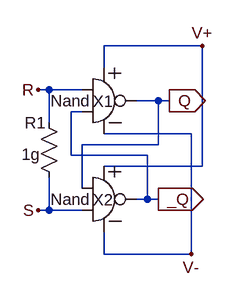
[diagram p0: schematic SrFfNand.asc]
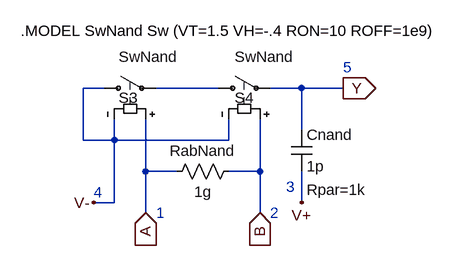
[diagram p1: sub-circuit nand.asc]
SrFfNand.asc, the LTspice schematic file:
Version 4
SHEET 1 880 680
WIRE -16 240 -32 240
WIRE -16 288 -16 240
WIRE -16 416 -32 416
WIRE -16 416 -16 368
WIRE 16 336 16 272
WIRE 32 240 -16 240
WIRE 32 272 16 272
WIRE 32 384 32 320
WIRE 32 416 -16 416
WIRE 64 208 64 176
WIRE 64 480 64 448
WIRE 128 336 16 336
WIRE 128 400 112 400
WIRE 128 400 128 336
WIRE 144 256 112 256
WIRE 144 320 32 320
WIRE 144 320 144 256
WIRE 144 400 128 400
WIRE 160 256 144 256
WIRE 192 304 64 304
WIRE 192 480 64 480
WIRE 192 480 192 304
WIRE 208 176 64 176
WIRE 208 352 64 352
WIRE 208 352 208 176
FLAG 144 400 _Q
IOPIN 144 400 Out
FLAG 160 256 Q
IOPIN 160 256 Out
FLAG -32 416 S
FLAG -32 240 R
FLAG 208 176 V+
FLAG 192 480 V-
SYMBOL res -32 272 R0
WINDOW 0 -20 16 Left 0
WINDOW 3 -24 62 Left 0
SYMATTR InstName R1
SYMATTR Value 1g
SYMBOL Nand 64 192 R0
WINDOW 0 -16 65 Left 0
WINDOW 3 -78 64 Left 0
SYMATTR InstName X1
SYMBOL Nand 64 336 R0
WINDOW 0 -16 65 Left 0
WINDOW 3 -78 64 Left 0
SYMATTR InstName X2

nand.asc, the sub-circuit schematic file:
Version 4
SHEET 1 896 680
WIRE -80 304 -80 224
WIRE -48 224 -80 224
WIRE -32 304 -80 304
WIRE -32 304 -32 272
WIRE -32 400 -64 400
WIRE -32 400 -32 304
WIRE 16 352 16 272
WIRE 16 416 16 352
WIRE 64 352 16 352
WIRE 128 224 32 224
WIRE 144 304 -32 304
WIRE 144 304 144 272
WIRE 192 352 144 352
WIRE 192 352 192 272
WIRE 192 416 192 352
WIRE 256 224 208 224
WIRE 256 288 256 224
WIRE 256 400 256 352
WIRE 320 224 256 224
FLAG 320 224 Y
IOPIN 320 224 Out
FLAG 16 416 A
IOPIN 16 416 In
FLAG 192 416 B
IOPIN 192 416 In
FLAG -64 400 V-
FLAG 256 400 V+
SYMBOL sw -64 224 R270
WINDOW 0 -15 39 VRight 0
WINDOW 3 48 39 VRight 0
SYMATTR InstName S3
SYMATTR Value SwNand
SYMBOL sw 112 224 R270
WINDOW 0 -15 41 VRight 0
WINDOW 3 48 41 VRight 0
SYMATTR InstName S4
SYMATTR Value SwNand
SYMBOL res 160 336 R90
WINDOW 0 0 56 VBottom 0
WINDOW 3 32 56 VTop 0
SYMATTR InstName RabNand
SYMATTR Value 1g
SYMBOL cap 240 288 R0
WINDOW 39 24 92 Left 0
SYMATTR SpiceLine Rpar=1k
SYMATTR InstName Cnand
SYMATTR Value 1p
TEXT -176 136 Left 0 !.MODEL SwNand Sw (VT=1.5 VH=-.4 RON=10 ROFF=1e9)
TEXT 32 416 Left 0 ;1
TEXT 208 416 Left 0 ;2
TEXT 320 192 Left 0 ;5
TEXT 232 376 Left 0 ;3
TEXT -64 384 Left 0 ;4

The netlist it stands for:
* SrFfNand.asc
R1 R S 1g
XX1 R _Q V+ V- Q nand params: Nand
XX2 Q S V+ V- _Q nand params: Nand

* block symbol definitions
.subckt nand A B V+ V- Y
S3 V- N001 A V- SwNand
S4 N001 Y B V- SwNand
RabNand B A 1g
Cnand Y V+ 1p Rpar=1k
.MODEL SwNand Sw (VT=1.5 VH=-.4 RON=10 ROFF=1e9)
* 1
* 2
* 5
* 3
* 4
.ends nand

.backanno
.end